# Altium project MotorController_STM32F4.PrjPcb
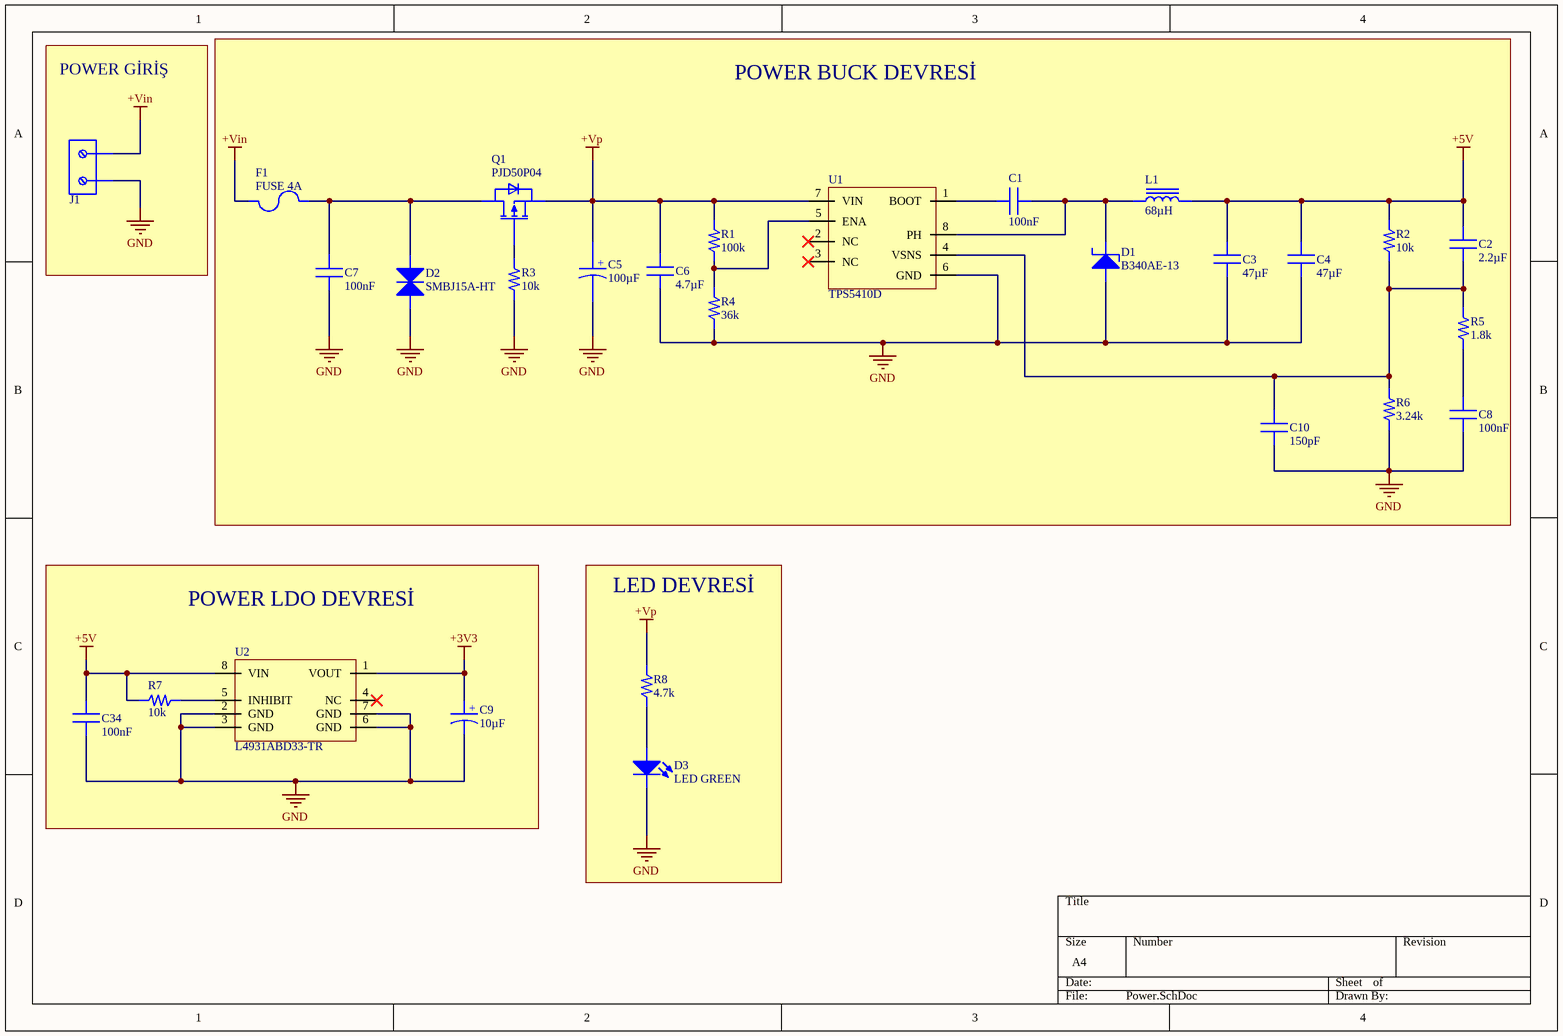
[diagram p0: Power.SchDoc]
4 sheets, 105 parts. Net scope: flat (ports and power ports of the same name join across sheets).
Board file: Motor_Controller.PcbDoc
Sheets:
  Power.SchDoc
  MCU.SchDoc
  Motor_Controller.SchDoc
  Sensors_and_External_Interfaces.SchDoc

## Sheet Power.SchDoc
size A4; DocumentNumber: 1; SheetNumber: 1; SheetTotal: 4

### Parts
C1  100nF  [CAP 0603 100NF]
C2  2.2µF  [CAP 0603 2.2uF]
C3  47µF  [CL32A476KOJNNNE]
C4  47µF  [CL32A476KOJNNNE]
C5  100µF  [CAP_EEHZA1H101P]
C6  4.7µF  [CAP 0603 4.7uF]
C7  100nF  [CAP 0603 100NF]
C8  100nF  [CAP 0603 100NF]
C9  10µF  [CAP_EEEFK1H100UR]
C10  150pF  [CAP 0603 150pF]
C34  100nF  [CAP 0603 100NF]
D1  B340AE-13  [DIODE B340AE-13]
D2  SMBJ15A-HT  [TVS DIODE SMBJ15A]
D3  LED GREEN  [LED GREEN 0603 APT1608CGCK]
F1  FUSE 4A  [FUSE 0805 MFU0805FF04000P100]
J1  2x1 5mm T.B.  [Terminal Block 2x1]  (value not drawn)
L1  68µH  [IND CBC3225T680KR 68uH]
Q1  PJD50P04  [TO252 (DPAK) IRFR024NTRPBF]
R1  100k  [RES 0402 ROYALOHM GENERAL]
R2  10k  [RES 0402 ROYALOHM GENERAL]
R3  10k  [RES 0402 ROYALOHM GENERAL]
R4  36k  [RES 0402 ROYALOHM GENERAL]
R5  1.8k  [RES 0402 ROYALOHM GENERAL]
R6  3.24k  [RES 0402 ROYALOHM GENERAL]
R7  10k  [RES 0402 ROYALOHM GENERAL]
R8  4.7k  [ROYALOHM 0603 RES]
U1  TPS5410D  [SOIC127TPS5410DR]
U2  L4931ABD33-TR  [LDO L4931ABD33-TR SOIC8]

### Blocks framed on the sheet
POWER GİRİŞ: J1
POWER BUCK DEVRESİ: C1-C8 C10 D1 D2 F1 L1 Q1 R1-R6 U1
POWER LDO DEVRESİ: C9 C34 R7 U2
LED DEVRESİ: D3 R8

### Nets
+3V3: C9.1 U2.1(VOUT)
+5V: C2.2 C3.2 C4.2 C34.2 L1.2 R2.2 R7.1 U2.8(VIN)
+Vin: F1.2 J1.1
+Vp: C5.1 C6.2 Q1.3(Source) R1.2 R8.2 U1.7(VIN)
GND: C3.1 C4.1 C5.2 C6.1 C7.1 C8.1 C9.2 C10.1 C34.1 D1.A(Anode) D2.1(A) D3.C(Cathode) J1.2 R3.1 R4.1 R6.1 U1.6(GND) U2.2(GND) U2.3(GND) U2.6(GND) U2.7(GND)
NetC1_1: C1.1 U1.1(BOOT)
NetC1_2: C1.2 D1.C(Cathode) L1.1 U1.8(PH)
NetC2_1: C2.1 C10.2 R2.1 R5.2 R6.2 U1.4(VSNS)
NetC7_2: C7.2 D2.2(C) F1.1 Q1.4(Drain)
NetC8_2: C8.2 R5.1
NetD3_A: D3.A(Anode) R8.1
NetQ1_1: Q1.1(Gate) R3.2
NetR1_1: R1.1 R4.2 U1.5(ENA)
NetR7_2: R7.2 U2.5(INHIBIT)

Not connected (* = marked no-connect by the designer): U1 2(NC)* 3(NC)*; U2 4(NC)*

### Notes on the sheet
- (in symbol CAP 10µF Electrolytic) +
- (in symbol CAP 100µF) +

### Library data of the parts
C1 C7 C8 C34 = CAP 0603 100nF: MLCC (1608) 0603 100nF 50VDC ±10% X7R AUTOMOTIVE CL10B104KB85PNC; Manufacturer: SAMSUNG; Operation Temperature: -55 °C ~ +125 °C; Manufacturer Code: CL10B104KB85PNC; Manufacturer Site: https://www.ozdisan.com/en/p/smt-smd-and-mlcc-capacitors-184/samsung-cl10b104kb85pnc-522216; Package / Case: 0603 (1608 Metric); Capacitance: 100nF; Voltage Rating: 50 VDC; Tolerance: ±10 %; Dielectric Material: X7R; Mounting Type: SMT
C2 = CAP 0603 2.2uF: MLCC (1608) 0603 2.2uF 16VDC ±10% X5R CL10A225KO8NNNC; Manufacturer: SAMSUNG; Operation Temperature: -55 °C ~ +85 °C; Mounting Type: SMT; Dielectric Material: X5R; Tolerance: ±10 %; Voltage Rating: 16 VDC; Capacitance: 2.2µF; Package / Case: 0603 (1608 Metric); Manufacturer Site: https://www.ozdisan.com/en/p/smt-smd-and-mlcc-capacitors-184/samsung-cl10a225ko8nnnc-497655; Manufacturer Code: CL10A225KO8NNNC
C3 C4 = CAP 1210 47µF: MLCC 1210 47uF 16VDC ±10% X5R   CL32A476KOJNNNE; Manufacturer: SAMSUNG; Operation Temperature: -55 °C ~ +85 °C; Capacitance: 47µF; Voltage Rating: 16 VDC; Tolerance: ±10 %; Dielectric Material: X5R; Manufacturer Site: https://www.ozdisan.com/en/p/smt-smd-and-mlcc-capacitors-184/samsung-cl32a476kojnnne-423179; Manufacturer Code: CL32A476KOJNNNE
C5 = CAP 100µF: CAP.EL.100µF 50V 10.5x10.5 105C SMD; Manufacturer: Panasonic; Manufacturer Code: EEH-ZA1H101P; Capacitor Type: Hybrid; Voltage Value: 50VDC; Tolerance: ±20 %; Surge Current: 2 A; Capacitance: 100µF; Package: Radial; Operating Temp.: -55 °C ~ +105 °C; Manufacturer Site: https://www.ozdisan.com/p/aluminyum-kapasitorler-180/panasoniceurope-eehza1h101p-614536
C6 = CAP 0603 4.7uF CL10A475KL8NRNC: MLCC (1608) 0603 4.7uF 35VDC ±10% X5R CL10A475KL8NRNC; Manufacturer: SAMSUNG; Operation Temperature: -55 °C ~ +85 °C; Manufacturer Site: https://www.ozdisan.com/en/p/smt-smd-and-mlcc-capacitors-184/samsung-cl10a475kl8nrnc-620226; Manufacturer Code: CL10A475KL8NRNC; Package / Case: 0603 (1608 Metric); Capacitance: 4.7µF; Voltage Rating: 35 VDC; Tolerance: ±10 %; Dielectric Material: X5R; Mounting Type: SMT
C9 = CAP 10µF Electrolytic: CAP.EL.10uF 50V 5x5.8 105C 2000H AEC-Q200 SMT; Manufacturer: PANASONIC; Manufacturer Code: EEEFK1H100UR; Voltage Rating: 50 VDC; Tolerance: ±20 %; Capacitance: 10µF; Capacitor Type: Electrolytic; Operating Temperature: 85 mA; Manufacturer Site: https://www.ozdisan.com/en/p/aluminyum-kapasitorler-180/panasoniceurope-eeefk1h100ur-1102281
C10 = CAP 0603 150pF: MLCC (1608) 0603 150pF 50VDC ±5% C0G (NP0) CL10C151JB8NNNC; Manufacturer: SAMSUNG; Operation Temperature: -55 °C ~ +125 °C; Manufacturer Code: CL10C151JB8NNNC; Manufacturer Site: https://www.ozdisan.com/en/p/smt-smd-and-mlcc-capacitors-184/samsung-cl10c151jb8nnnc-29957; Capacitance: 150pF; Package / Case: 0603 (1608 Metric); Voltage Rating: 50 VDC; Tolerance: ±5 %; Dielectric Material: C0G (NP0); Mounting Type: SMT
D1 = DIODE SCHOTTKY B340AE-13: DIODE SCHOTTKY 3A 40V SMA DO-214AC; Manufacturer: DIODES; Non-Repetitive Peak Forward Surge Current: 80A; Forward Voltage Drop: 0.45V; Peak Repetitive Reverse Voltage (VRRM): 40V; Average Rectified Current: 3A; Operating Temperature: -55 °C ~ +150 °C; Manufacturer Site: https://www.ozdisan.com/en/p/schottky-diodes-385/diodes-b340ae-13-736716; Manufacturer Code: B340AE-13
D2 = DIODE TVS SMBJ15A-HT: DIODE TVS 600W 15V DO214AA SMB; pin to pad: 1>A 2>C; Manufacturer: HOTTECH; Direction: Uni-Direction; Peak Pulse Current: 24.6; Manufacturer Site: https://www.ozdisan.com/p/TVS-Diodes-386/hottech-smbj15a-ht-503592?gad_source=1&gad_campaignid=22862662318&gbraid=0AAAAADZaco9GRDpwp6nwxImxnSPU74-HV&gclid=CjwKCAiAmp3LBhAkEiwAJM2JUNsfUTvu17OkGEIhWr_5BT7x3v2LizKiIaGxyMlL1g7MMILW0EtdSxoCxEMQAvD_BwE; Category: TVS; Vwm: 15V; Operating Temp.: -55 °C ~ +150 °C; Manufacturer Code: SMBJ15A-HT
D3 = SMD LED GREEN APT1608CGCK: LED GREEN CLEAR CHIP SMD; Manufacturer: KINGBRIGHT; Max Power: 75 mW; Light Intensity: 18 - 35 cmd; Transmission Voltage: 2.1 - 2.5V; Transmission Current: 30 mA; Manufacturer Site: https://www.ozdisan.com/p/sinyal-ledler-tek-renkli-361/kingbright-apt1608cgck-1050108; Color: Green; Package Size: 0603; Operating Temp.: -30 °C ~ +85 °C; Manufacturer Code: APT1608CGCK
F1 = FUSE: FUSE BOARD MOUNT 0805 4A 32VDC; Manufacturer: VISHAY; Manufacturer Code: MFU0805FF04000P100; Breaking Capacity: 50A; Mounting Type: SMT; Fuse Type: Fuse Board; Current Rating: 4A; Voltage Rating: 32VDC; Operating Temp.: -55°C~+125 °C; Manufacturer Site: https://www.ozdisan.com/p/sigortalar-849/vishay-mfu0805ff04000p100-617478
J1 = Terminal Block 2x1: TERM.BLK.5.00MM 2P PCB TYPE 0 BOY BLUE; Manufacturer: DEGSON; Manufacturer Code: DG301-5.0-02P-12-00AH; Voltage Rating: 300V; Current Rating: 15A; Mounting Type: THT; Number of Pins: 2; Operating Temp.: -40°C~+105 °C; Manufacturer Site: https://www.ozdisan.com/p/pcb-klemensler-410/degson-dg301-5-0-02p-12-00ah-349366
L1 = INDUCTOR 68µH SMD 744066680: INDUCTOR FIXED 68UH 10x10mm SMD 744066680; Manufacturer: WURTH; Tolerance: ±30 %; Current Rating: 1.5A; DC Resistance (DCR): 185 m Ohms; Manufacturer Site: https://www.ozdisan.com/p/sabit-induktorler-468/wurth-744066680-635583; Inductance: 68µH; Operating Temperature: -40 °C ~ +125 °C; Manufacturer Code: 744066680
Q1 = P-CH Mosfet 40V 9A PJD50P04-AU_L2_000A1: MOSFET DIS.50A 40V P-CH AUTOMOTIVE TO-252AA SMT; Manufacturer: PANJIT; Power Dissipation: 70 W; Rds On: 10 m Ohms; Current (25°C): 50 A; Voltage: 40 V; Fet Type: P-CH; Package / Case: TO252 (DPAK); Mounting Type: SMT; Manufacturer Site: https://www.ozdisan.com/en/p/discrete-mosfets-435/panjit-pjd50p04-au-l2-000a1-979715; Manufacturer Code: PJD50P04-AU_L2_000A1
R1 = RES 0402 100k 0402WGF1003TCE: RES.(1005) 0402 100K Ohms 1% 1/16W 100PPM / 0402WGF1003TCE; Manufacturer: ROYALOHM; Tolerance: ±5 %; Max Working Current: 1A; Max Working Voltage: 50V; Manufacturer Site: https://www.ozdisan.com/p/smt-smd-ve-cip-direncler-194/royalohm-0402wgf1003tce-359898; Power: 1/16 W; Package / Case: 0402; Manufacturer Code: 0402WGF1003TCE; Resistance Value: 100 k Ohms
R2 R3 R7 = RES 0402 10k: RES.(1005) 0402 10K Ohms 5% 1/16W 100PPM 0402WGJ0103TCE; Manufacturer: ROYALOHM; Tolerance: %5; Voltage Rating: 5V; Manufacturer Site: https://www.ozdisan.com/p/smt-smd-ve-cip-direncler-194/royalohm-0402wgj0103tce-362331; Package Size: 0402; Manufacturer Code: 0402WGJ0103TCE; Power: 1/16W; Resistance Value: 10k Ohms
R4 = RES 0402 36k 0402WGF3602TCE: RES.(1005) 0402 36K Ohms 1% 1/16W 100PPM 0402WGF3602TCE; Manufacturer: ROYALOHM; Power: 1/16 W-S; Max. Working Voltage: 50V; Max. Working Current: 1A; Manufacturer Site: https://www.ozdisan.com/p/smt-smd-ve-cip-direncler-194/royalohm-0402wgf3602tce-359889; Resistance Value: 36 k Ohms; Tolerance: ±1 %; Manufacturer Code: 0402WGF3602TCE
R5 = RES 0402 1.8k 0402WGJ0182TCE: RES.(1005) 0402 1.8K Ohms 5% 1/16W 100PPM 0402WGJ0182TCE; Manufacturer: ROYALOHM; Working Voltage: 50 V; Tolerance: ±5 %; Resistance Value: 1.8 k Ohms; Power: 1/16 W; Manufacturer Code: 0402WGJ0182TCE; Manufacturer Site: https://www.ozdisan.com/p/smt-smd-ve-cip-direncler-194/royalohm-0402wgj0182tce-506663
R6 = RES 0402 3.24k 0402WGF3241TCE: RES 0805 3.24k Ohms 1% 1/8W-S 100PPM 0402WGF3241TCE; Manufacturer: ROYALOHM; Power: 1/16 W-S; Working Voltage: 50V; Max Working Current: 1A; Manufacturer Site: https://www.ozdisan.com/p/smt-smd-ve-cip-direncler-194/royalohm-0402wgf3241tce-506267; Resistance Value: 3.24 k Ohms; Tolerance: ±1 %; Manufacturer Code: 0402WGF3241TCE
R8 = RES 0402 4.7k 0603SAJ0472T5E: RES.(1608) 0603 4.7K Ohms 5% 1/10W-S 100PPM 0603SAJ0472T5E; Manufacturer: ROYALOHM; Voltage Rating: 50V; Power: 1/16W; Package Size: 0402; Tolerance: ±5 %; Manufacturer Site: https://www.ozdisan.com/p/smt-smd-ve-cip-direncler-194/royalohm-0603saj0472t5e-336241; Manufacturer Code: 0603SAJ0472T5E; Resistance Value: 4.7k Ohms
U1 = Buck Converter TPS5410D: IC-5410DR REG BUCK ADJ 1A 8SOIC SMD TI; Manufacturer: TEXAS TI; Switching Function: Step-Down; Output Type: Adjustable; Input Voltage: 5.5 to 36 V; Switching Frequency: 500 kHz; Mounting Type: SMT; Package / Case: SOIC8; Output Voltage: Output Voltage; Output Current: 1A; Operating Temperature: -40 °C ~ +125 °C; Manufacturer Site: https://www.ozdisan.com/en/p/dc-dc-voltaj-regulatorleri-275/texas-tps5410dr-442302; Manufacturer Code: TPS5410D
U2 = LDO L4931ABD33: IC REG LINEAR 3.3V 250MA 8SO L4931ABD33; Manufacturer: STM; Input Voltage (Operating): 4 to 20 V; Output Voltage: 3.3 V; Output Current: 250 mA; Operating Temperature: -40 °C ~ +125 °C; Manufacturer Site: https://www.ozdisan.com/en/p/linear-voltage-regulators-279/stm-l4931abd33-tr-1325219; Manufacturer Code: L4931ABD33

## Sheet MCU.SchDoc: Motor Controller Board
size A4; DrawnBy: Hüseyin Yanar; DocumentNumber: 2; Revision: VER 1.0; SheetNumber: 2; SheetTotal: 4
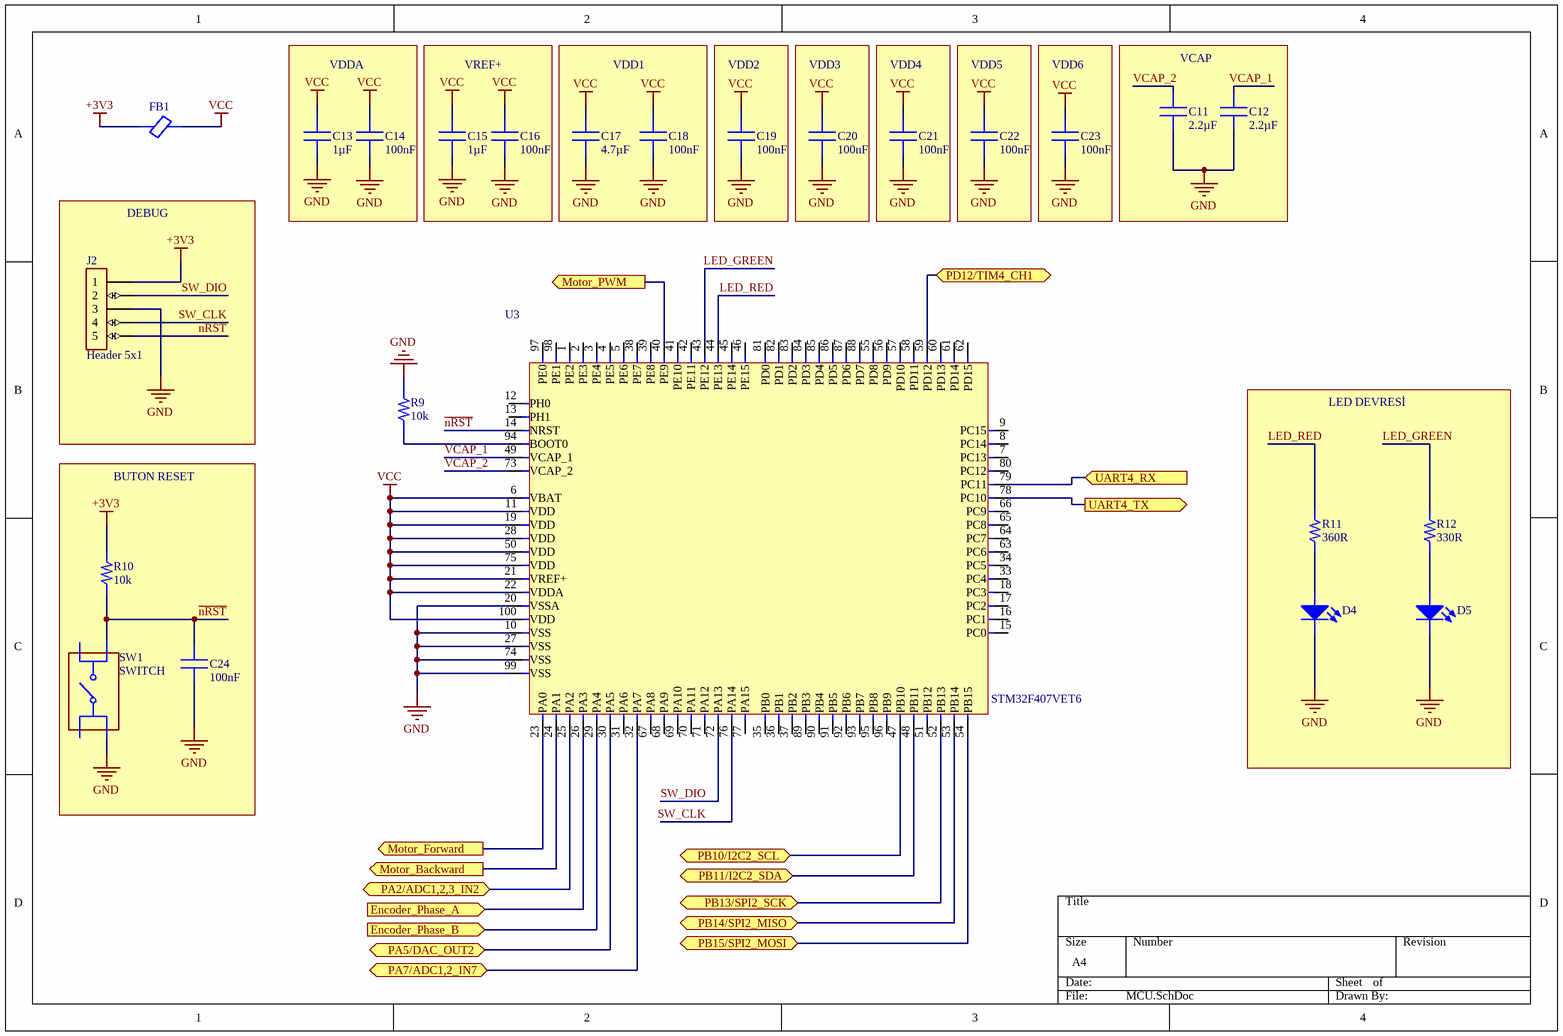
[diagram p1: MCU.SchDoc]

### Parts
C11  2.2µF  [CAP 0402 2.2UF]
C12  2.2µF  [CAP 0402 2.2UF]
C13  1µF  [CAP 1uF 0402]
C14  100nF  [CAP 100nF 0402]
C15  1µF  [CAP 1uF 0402]
C16  100nF  [CAP 100nF 0402]
C17  4.7µF  [CAP 0402 4.7uF]
C18  100nF  [CAP 100nF 0402]
C19  100nF  [CAP 100nF 0402]
C20  100nF  [CAP 100nF 0402]
C21  100nF  [CAP 100nF 0402]
C22  100nF  [CAP 100nF 0402]
C23  100nF  [CAP 100nF 0402]
C24  100nF  [CAP 100nF 0402]
D4  LED RED  [LED RED 0603 APT1608EC]  (value not drawn)
D5  LED GREEN  [LED GREEN 0603 APT1608CGCK]  (value not drawn)
FB1  BLM18PG221SN1D  [FB 0603 BLM18PG221SN1D]  (value not drawn)
J2  Header 5x1  [5x1 Header]
R9  10k  [RES 0402 ROYALOHM GENERAL]
R10  10k  [RES 0402 ROYALOHM GENERAL]
R11  360R  [ROYALOHM 0603 RES]
R12  330R  [ROYALOHM 0603 RES]
SW1  SWITCH  [PTS647SM50SMTR2 SMD BUTTON]
U3  STM32F407VET6  [LQFP100-0.5-13.8X13.8MM]

### Blocks framed on the sheet
VDDA: C13 C14
VREF+: C15 C16
VDD1: C17 C18
VDD2: C19
VDD3: C20
VDD4: C21
VDD5: C22
VDD6: C23
VCAP: C11 C12
DEBUG: J2
LED DEVRESİ: D4 D5 R11 R12
BUTON RESET: C24 R10 SW1

### Ports
Encoder_Phase_A (in, see Sensors_and_External_Interfaces[1A]), Encoder_Phase_B (in, see Sensors_and_External_Interfaces[1B]), Motor_Backward (out, see Motor_Controller[1A]), Motor_Forward (out, see Motor_Controller[1A]), Motor_PWM (out, see Motor_Controller[3C]), PA2/ADC1,2,3_IN2 (bidir, see Sensors_and_External_Interfaces[3B]), PA5/DAC_OUT2 (bidir, see Sensors_and_External_Interfaces[3B]), PA7/ADC1,2_IN7 (bidir, see Sensors_and_External_Interfaces[3B]), PB10/I2C2_SCL (bidir, see Sensors_and_External_Interfaces[3A]), PB11/I2C2_SDA (bidir, see Sensors_and_External_Interfaces[3A]), PB13/SPI2_SCK (bidir, see Sensors_and_External_Interfaces[3A]), PB14/SPI2_MISO (bidir, see Sensors_and_External_Interfaces[3A]), PB15/SPI2_MOSI (bidir, see Sensors_and_External_Interfaces[3A]), PD12/TIM4_CH1 (bidir, see Sensors_and_External_Interfaces[3A]), UART4_RX (in, see Sensors_and_External_Interfaces[3A]), UART4_TX (out, see Sensors_and_External_Interfaces[3B])

### Nets
+3V3: FB1.1 J2.1 R10.2
GND: C11.1 C12.1 C13.1 C14.1 C15.1 C16.1 C17.1 C18.1 C19.1 C20.1 C21.1 C22.1 C23.1 C24.1 D4.C(Cathode) D5.C(Cathode) J2.3 R9.2 SW1.2(A2) U3.10(VSS) U3.20(VSSA) U3.27(VSS) U3.74(VSS) U3.99(VSS)
VCC: C13.2 C14.2 C15.2 C16.2 C17.2 C18.2 C19.2 C20.2 C21.2 C22.2 C23.2 FB1.2 U3.6(VBAT) U3.11(VDD) U3.19(VDD) U3.21(VREF+) U3.22(VDDA) U3.28(VDD) U3.50(VDD) U3.75(VDD) U3.100(VDD)
~{nRST}: C24.2 J2.5 R10.1 SW1.4(B2) U3.14(NRST)
LED_GREEN: R12.2 U3.43(PE12)
LED_RED: R11.2 U3.44(PE13)
Motor_Backward: U3.24(PA1) ; port Motor_Backward
Motor_Forward: U3.23(PA0) ; port Motor_Forward
SW_CLK: J2.4 U3.76(PA14)
SW_DIO: J2.2 U3.72(PA13)
VCAP_1: C12.2 U3.49(VCAP_1)
VCAP_2: C11.2 U3.73(VCAP_2)
NetD4_A: D4.A(Anode) R11.1
NetD5_A: D5.A(Anode) R12.1
NetJ4_1: U3.59(PD12) ; port PD12/TIM4_CH1
NetJ4_2: U3.54(PB15) ; port PB15/SPI2_MOSI
NetJ4_3: U3.53(PB14) ; port PB14/SPI2_MISO
NetJ4_4: U3.52(PB13) ; port PB13/SPI2_SCK
NetJ4_5: U3.48(PB11) ; port PB11/I2C2_SDA
NetJ4_6: U3.47(PB10) ; port PB10/I2C2_SCL
NetJ4_7: U3.32(PA7) ; port PA7/ADC1,2_IN7
NetJ4_8: U3.30(PA5) ; port PA5/DAC_OUT2
NetJ4_9: U3.25(PA2) ; port PA2/ADC1,2,3_IN2
NetR9_1: R9.1 U3.94(BOOT0)
NetR26_2: U3.40(PE9) ; port Motor_PWM
NetR35_2: U3.79(PC11) ; port UART4_RX
NetR36_2: U3.26(PA3) ; port Encoder_Phase_A
NetR37_2: U3.78(PC10) ; port UART4_TX
NetR38_2: U3.29(PA4) ; port Encoder_Phase_B

Not connected (* = marked no-connect by the designer): SW1 1(A1) 3(B1); U3 1(PE2) 2(PE3) 3(PE4) 4(PE5) 5(PE6) 7(PC13) 8(PC14) 9(PC15) 12(PH0) 13(PH1) 15(PC0) 16(PC1) 17(PC2) 18(PC3) 31(PA6) 33(PC4) 34(PC5) 35(PB0) 36(PB1) 37(PB2) 38(PE7) 39(PE8) 41(PE10) 42(PE11) 45(PE14) 46(PE15) 51(PB12) 55(PD8) 56(PD9) 57(PD10) 58(PD11) 60(PD13) 61(PD14) 62(PD15) 63(PC6) 64(PC7) 65(PC8) 66(PC9) 67(PA8) 68(PA9) 69(PA10) 70(PA11) 71(PA12) 77(PA15) 80(PC12) 81(PD0) 82(PD1) 83(PD2) 84(PD3) 85(PD4) 86(PD5) 87(PD6) 88(PD7) 89(PB3) 90(PB4) 91(PB5) 92(PB6) 93(PB7) 95(PB8) 96(PB9) 97(PE0) 98(PE1)

### Notes on the sheet
- VDDA 100nF ve 1µF VDDA/VSSA pinlerine en yakın olacak
  GND dönüşleri kısa olacak ve mümkünse analog GND bölgesine temiz inecek
  VDD 100nF’ler de her VDD pin grubuna yakın olacak.

### Library data of the parts
C11 C12 = CAP 0402 2.2uF CL05A225KO5NQNC: MLCC (1005) 0402 2.2uF 16VDC ±10% X5R CL05A225KO5NQNC; Manufacturer: SAMSUNG; Operation Temperature: -55 °C ~ +85 °C; Manufacturer Code: CL05A225KO5NQNC; Manufacturer Site: https://www.ozdisan.com/en/p/smt-smd-and-mlcc-capacitors-184/samsung-cl05a225ko5nqnc-521869; Package / Case: 0402 (1005 Metric); Capacitance: 2.2µF; Voltage Rating: 16 VDC; Tolerance: ±10 %; Dielectric Material: X5R
C13 C15 = CAP 0402 1µF CL05A105KO5NNNC: MLCC (1005) 0402 1uF 16VDC ±10% X5R CL05A105KO5NNNC; Manufacturer: SAMSUNG; Operation Temperature: -55 °C ~ +85 °C; Manufacturer Code: CL05A105KO5NNNC; Manufacturer Site: https://www.ozdisan.com/en/p/smt-smd-and-mlcc-capacitors-184/samsung-cl05a105ko5nnnc-402953; Package / Case: 0402 (1005 Metric); Capacitance: 1µF; Voltage Rating: 16 VDC; Tolerance: ±10 %; Dielectric Material: X5R; Mounting Type: SMT
C14 C16 C18-C23 = CAP 0402 100nF: MLCC (1005) 0402 100nF 16VDC ±10% X7R; Manufacturer Code: CL05B104KO5NNNC; Manufacturer: SAMSUNG; Operation Temperature: -55 °C ~ +125 °C; Dielectric Material: X7R; Tolerance: ±10 %; Voltage Rating: 16 VDC; Package / Case: 0402 (1005 Metric); Mounting Type: SMT; Manufacturer Site: https://www.ozdisan.com/en/p/smt-smd-and-mlcc-capacitors-184/samsung-cl05b104ko5nnnc-336698; Capacitance: 100 nF
C17 = CAP 0402 4.7uF CL05A475MO5LUNC: MLCC (1005) 0402 4.7uF 16VDC ±20% X5R CL05A475MO5LUNC; Manufacturer: SAMSUNG; Operation Temperature: -55 °C ~ +85 °C; Manufacturer Code: CL05A475MO5LUNC; Manufacturer Site: https://www.ozdisan.com/en/p/smt-smd-and-mlcc-capacitors-184/samsung-cl05a475mo5lunc-1212612; Package / Case: 0402 (1005 Metric); Capacitance: 4.7µF; Voltage Rating: 16 VDC; Tolerance: ±20 %; Dielectric Material: X5R; Mounting Type: SMT
C24 = CAP 0402 100nF CL05B104KO5NNNC: MLCC (1005) 0402 100nF 16VDC ±10% X7R CL05B104KO5NNNC; Manufacturer: SAMSUNG; Operation Temperature: -55 °C ~ +125 °C; Dielectric Material: X7R; Tolerance: ±10 %; Voltage Rating: 16 VDC; Package / Case: 0402 (1005 Metric); Mounting Type: SMT; Manufacturer Site: https://www.ozdisan.com/en/p/smt-smd-and-mlcc-capacitors-184/samsung-cl05b104ko5nnnc-336698; Manufacturer Code: CL05B104KO5NNNC; Capacitance: 100 nF
D4 = SMD LED RED APT1608EC: LED SMD 0603 RED 617nm CLEAR CHIP SMD; Manufacturer: KINGBRIGHT; Max Power: 75 mW; Transmission Voltage: 2.1V - 2.5V; Transmission Current: 30 mA; Manufacturer Site: https://www.ozdisan.com/p/sinyal-ledler-tek-renkli-361/kingbright-apt1608ec-1046629; Operating Temp.: -40 °C ~ +85 °C; Manufacturer Code: APT1608EC
D5 = SMD LED GREEN APT1608CGCK: as D3 on sheet Power; Manufacturer Site: https://www.ozdisan.com/p/sinyal-ledler-tek-renkli-361/kingbright-apt1608cgck-1050108; Color: Green; Package Size: 0603; Operating Temp.: -30 °C ~ +85 °C; Manufacturer Code: APT1608CGCK
FB1 = Ferrite Bead BLM18PG221SN1D: FERRITE BEAD 0805 330R/100MHZ  BLM18PG221SN1D  SMD; Manufacturer: MURATA; Impedance: 330 Ohms; Tolerance: ±25 %; Current: 1.5 A; DC Resistor(DCR): 100 m Ohms; Package Size: 0805; Manufacturer Code: BLM18PG221SN1D; Manufacturer Site: https://www.ozdisan.com/p/bead-feritler-469/murata-blm18pg221sn1d-484088
J2 = Header 5x1 for SWD: PIN HEADER 5PIN (5x1) 2.54mm THT V/T; Manufacturer: CONNFLY; Manufacturer Code: DS1021-1X5SF11-B; Pin Overall Length: 15.04 mm; Pin Spacing: 2.54 mm; Insulation Height: 2.5 mm; Manufacturer Site: https://www.ozdisan.com/p/pin-headerlar-293/connfly-ds1021-1x5sf11-b-423156
R9 R10 = RES 0402 10k: as R2 on sheet Power; Manufacturer Site: https://www.ozdisan.com/p/smt-smd-ve-cip-direncler-194/royalohm-0402wgj0103tce-362331; Package Size: 0402; Manufacturer Code: 0402WGJ0103TCE; Power: 1/16W; Resistance Value: 10k Ohms
R11 = RES 0603 360R 0603SAJ0361T5E: RES.(1608) 0603 360 Ohms 5% 1/10W-S 100PPM 0603SAJ0361T5E; Manufacturer: ROYALOHM; Working Voltage: 75 V; Manufacturer Code: 0603SAJ0361T5E; Manufacturer Site: https://www.ozdisan.com/en/p/smt-smd-and-chip-resistors-194/royalohm-0603saj0361t5e-404344; Resistance Value: 360 Ohms; Tolerance: ±5 %
R12 = RES 0603 330R: RES 0603 330 Ohms 5% 1/10W-S 100PPM; Manufacturer Code: 0603SAJ0331T5E; Manufacturer: ROYALOHM; Power: 1/10W; Voltage Rating: 75V; Resistance Value: 330 Ohm; Manufacturer Site: https://www.ozdisan.com/p/smt-smd-ve-cip-direncler-194/royalohm-0603saj0331t5e-336229; Tolerance: ±5 %; Package Size: 0603
SW1 = SMD BUTTON PTS647SM50SMTR2LFS: SWITCH TACT 6.00x6.00 8.00mm 160gF SMT V/T PTS647SM50SMTR2LFS; Manufacturer: LITTELFUSE-C&K; Max Current: 50mA; Max Voltage: 12V; Actuating Force: 180 gF; Manufacturer Site: https://www.ozdisan.com/p/tact-sivicler-485/littelfuse-ck-pts647sm50smtr2lfs-1018623; Dimension: 4.5x4.5 mm; Operating Temp.: -25 °C ~ +70 °C; Manufacturer Code: PTS647SM50SMTR2LFS
U3 = MCU-STM32F407VET6(LQFP100): IC-32F407V MCU 32BIT 512KB FLASH 100LQFP; Manufacturer: STM; Manufacturer Code: STM32F407VET6TR; Supply Voltage: 1.8 to 3.6 V; Speed: 168 MHz; Program Memory Size: 512 KB (512 K x 8); Package / Case: LQFP100; Memory Type: FLASH; Number of Bits: 32 Bit; Operating Temperature: -40 °C ~ +85 °C; Manufacturer Site: https://www.ozdisan.com/en/p/microcontrollers-218/stm-stm32f407vet6tr-492058

## Sheet Motor_Controller.SchDoc
size A4; DocumentNumber: 3; SheetNumber: 3; SheetTotal: 4
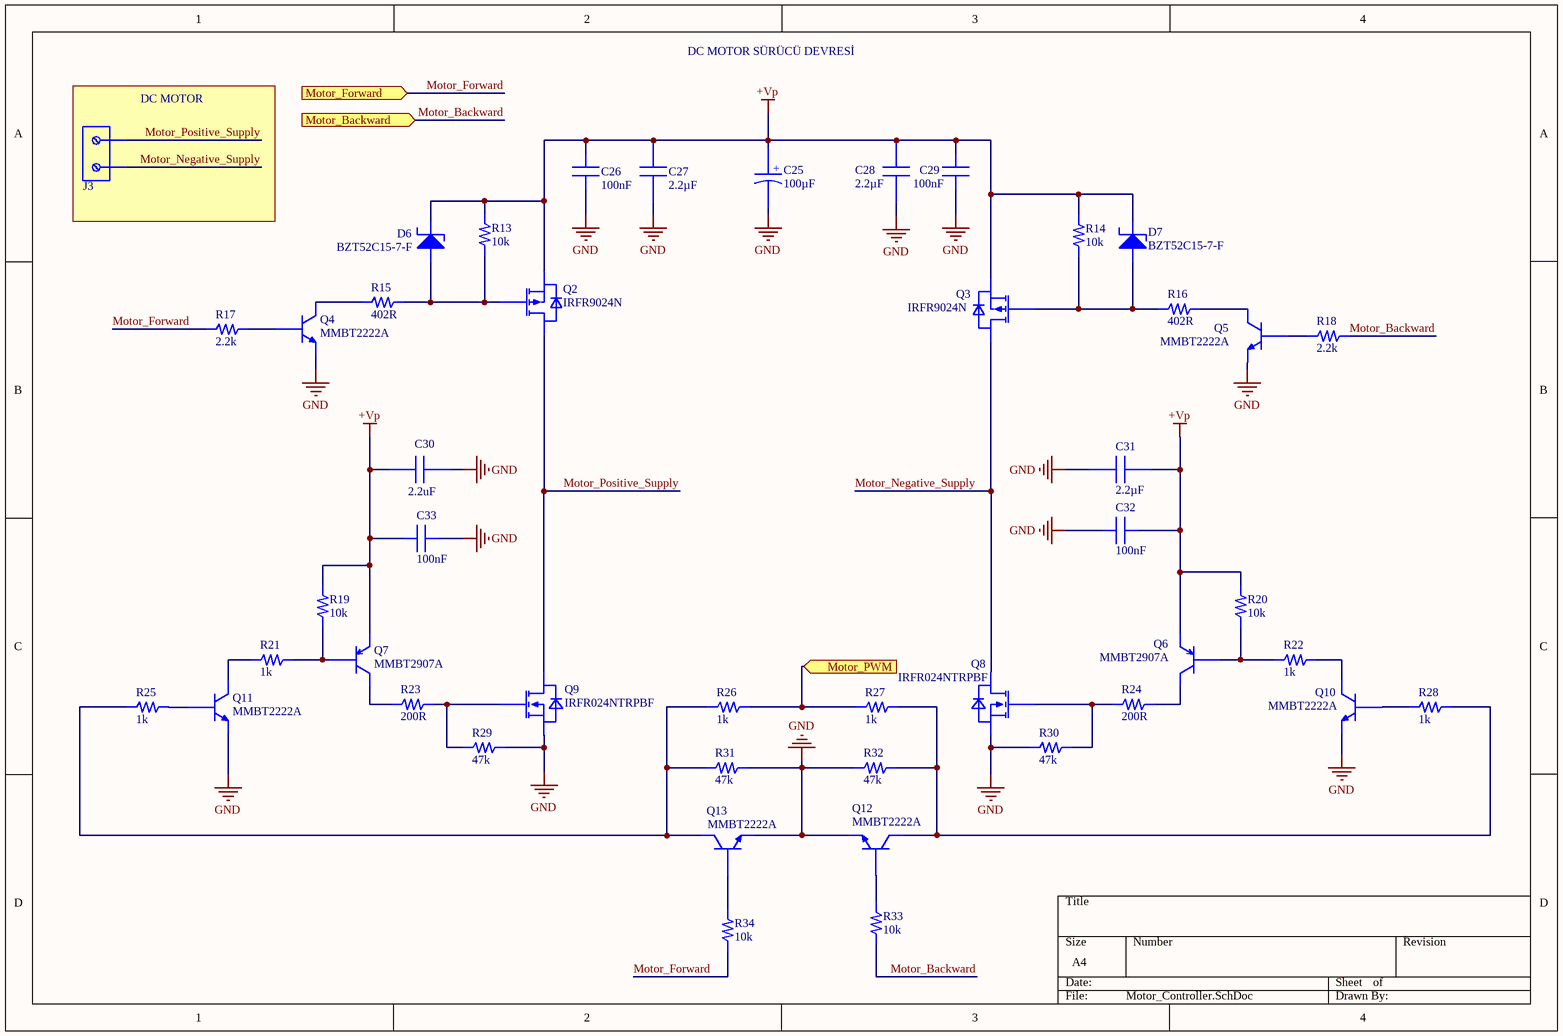
[diagram p2: Motor_Controller.SchDoc]

### Parts
C25  100µF  [CAP_EEHZA1H101P]
C26  100nF  [CL21B104KBCNNNC]
C27  2.2µF  [CAPC3216X180N]
C28  2.2µF  [CAPC3216X180N]
C29  100nF  [CL21B104KBCNNNC]
C30  2.2µF  [CAPC3216X180N]  (value not drawn)
C31  2.2µF  [CAPC3216X180N]
C32  100nF  [CL21B104KBCNNNC]
C33  100nF  [CL21B104KBCNNNC]
D6  BZT52C15-7-F  [DIODE ZENER BZT52C15-7-F]
D7  BZT52C15-7-F  [DIODE ZENER BZT52C15-7-F]
J3  2x1 5mm T.B.  [Terminal Block 2x1]  (value not drawn)
Q2  IRFR9024N  [TO252 (DPAK) IRFR024NTRPBF]
Q3  IRFR9024N  [TO252 (DPAK) IRFR024NTRPBF]
Q4  MMBT2222A  [SOT23-3 MMBT2222A-HT]
Q5  MMBT2222A  [SOT23-3 MMBT2222A-HT]
Q6  MMBT2907A  [TRANS_MMBT2907A]
Q7  MMBT2907A  [TRANS_MMBT2907A]
Q8  IRFR024NTRPBF  [TO252 (DPAK) IRFR024NTRPBF]
Q9  IRFR024NTRPBF  [TO252 (DPAK) IRFR024NTRPBF]
Q10  MMBT2222A  [SOT23-3 MMBT2222A-HT]
Q11  MMBT2222A  [SOT23-3 MMBT2222A-HT]
Q12  MMBT2222A  [SOT23-3 MMBT2222A-HT]
Q13  MMBT2222A  [SOT23-3 MMBT2222A-HT]
R13  10k  [RES 0402 ROYALOHM GENERAL]
R14  10k  [RES 0402 ROYALOHM GENERAL]
R15  402R  [CHIP RES 0805 1k]
R16  402R  [CHIP RES 0805 1k]
R17  2.2k  [RES 0402 ROYALOHM GENERAL]
R18  2.2k  [RES 0402 ROYALOHM GENERAL]
R19  10k  [RES 0402 ROYALOHM GENERAL]
R20  10k  [RES 0402 ROYALOHM GENERAL]
R21  1k  [RES 0402 ROYALOHM GENERAL]
R22  1k  [RES 0402 ROYALOHM GENERAL]
R23  200R  [CHIP RES 0805 1k]
R24  200R  [CHIP RES 0805 1k]
R25  1k  [RES 0402 ROYALOHM GENERAL]
R26  1k  [RES 0402 ROYALOHM GENERAL]
R27  1k  [RES 0402 ROYALOHM GENERAL]
R28  1k  [RES 0402 ROYALOHM GENERAL]
R29  47k  [RES 0402 ROYALOHM GENERAL]
R30  47k  [RES 0402 ROYALOHM GENERAL]
R31  47k  [RES 0402 ROYALOHM GENERAL]
R32  47k  [RES 0402 ROYALOHM GENERAL]
R33  10k  [RES 0402 ROYALOHM GENERAL]
R34  10k  [RES 0402 ROYALOHM GENERAL]

### Blocks framed on the sheet
DC MOTOR: J3

### Ports
Motor_Backward (in, see MCU[1D]), Motor_Forward (in, see MCU[1D]), Motor_PWM (in, see MCU[2B])

### Nets
+Vp: C25.1 C26.2 C27.2 C28.2 C29.2 C30.1 C31.2 C32.2 C33.1 D6.2(Cathode) D7.2(Cathode) Q2.3(Source) Q3.3(Source) Q6.2(Emitter) Q7.2(Emitter) R13.2 R14.2 R19.2 R20.2
GND: C25.2 C26.1 C27.1 C28.1 C29.1 C30.2 C31.1 C32.1 C33.2 Q4.2(Emitter) Q5.2(Emitter) Q8.3(Source) Q9.3(Source) Q10.2(Emitter) Q11.2(Emitter) Q12.2(Emitter) Q13.2(Emitter) R29.2 R30.1 R31.2 R32.1
Motor_Backward: R18.2 R33.1 ; port Motor_Backward
Motor_Forward: R17.1 R34.1 ; port Motor_Forward
Motor_Negative_Supply: J3.2 Q3.4(Drain) Q8.4(Drain)
Motor_Positive_Supply: J3.1 Q2.4(Drain) Q9.4(Drain)
NetD6_1: D6.1(Anode) Q2.1(Gate) R13.1 R15.2
NetD7_1: D7.1(Anode) Q3.1(Gate) R14.1 R16.1
NetQ4_1: Q4.1(Base) R17.2
NetQ4_3: Q4.3(Collector) R15.1
NetQ5_1: Q5.1(Base) R18.1
NetQ5_3: Q5.3(Collector) R16.2
NetQ6_1: Q6.1(Base) R20.1 R22.1
NetQ6_3: Q6.3(Collector) R24.2
NetQ7_1: Q7.1(Base) R19.1 R21.2
NetQ7_3: Q7.3(Collector) R23.1
NetQ8_1: Q8.1(Gate) R24.1 R30.2
NetQ9_1: Q9.1(Gate) R23.2 R29.1
NetQ10_1: Q10.1(Base) R28.1
NetQ10_3: Q10.3(Collector) R22.2
NetQ11_1: Q11.1(Base) R25.2
NetQ11_3: Q11.3(Collector) R21.1
NetQ12_1: Q12.1(Base) R33.2
NetQ12_3: Q12.3(Collector) R27.2 R28.2 R32.2
NetQ13_1: Q13.1(Base) R34.2
NetQ13_3: Q13.3(Collector) R25.1 R26.1 R31.1
NetR26_2: R26.2 R27.1 ; port Motor_PWM

### Notes on the sheet
- DC MOTOR SÜRÜCÜ DEVRESİ
- (in symbol CAP 100µF) +
- (in symbol CAP 1206 2.2µF) 2.2uF

### Library data of the parts
C25 = CAP 100µF: as C5 on sheet Power; Capacitance: 100µF; Package: Radial; Operating Temp.: -55 °C ~ +105 °C; Manufacturer Site: https://www.ozdisan.com/p/aluminyum-kapasitorler-180/panasoniceurope-eehza1h101p-614536
C26 C29 C32 C33 = CAP 0805 100nF: MLCC 0805 100nF 50VDC ±10% X7R; Manufacturer: SAMSUNG; Capacitance: 100nF; Voltage Rating: 50VDC; Dielectric: X7R; Package Size: 0805; Operating Temp.: -55 °C ~ +125 °C; Tolerance: ±10 %; Manufacturer Site: https://www.ozdisan.com/p/smt-smd-ve-mlcc-kapasitorler-184/samsung-cl21b104kbcnnnc-14777; Manufacturer Code: CL21B104KBCNNNC
C27 C28 C30 C31 = CAP 1206 2.2µF: MLCC 1206 2.2µF 50VDC ±10% X7R; Manufacturer: SAMSUNG; Manufacturer Code: CL31B225KBHVPNE; Capacitance: 2.2µF; Voltage Value: 50VDC; Tolerance: ±10 %; Dielectric: X7R; Operating Temp.: -55 °C ~ +125 °C; Manufacturer Site: https://www.ozdisan.com/p/smt-smd-ve-mlcc-kapasitorler-184/samsung-cl31b225kbhvpne-523411
D6 D7 = DIODE ZENER 15V BZT52C15-7-F: DIODE ZENER 500mW 15V ±5% SOD123 SMT; pin to pad: 1>A 2>C; Manufacturer: DIODES; Reverse Current: 100 nA; Manufacturer Site: https://www.ozdisan.com/p/zener-diyotlar-390/diodes-bzt52c15-7-f-444889; Zener Voltage: 15V; Operating Temp.: -65 °C ~ +150 °C; Tolerance: ±5 %; Power: 500 mW; Manufacturer Code: BZT52C15-7-F
J3 = Terminal Block 2x1: as J1 on sheet Power; Mounting Type: THT; Number of Pins: 2; Operating Temp.: -40°C~+105 °C; Manufacturer Site: https://www.ozdisan.com/p/pcb-klemensler-410/degson-dg301-5-0-02p-12-00ah-349366
Q2 Q3 = P Channel Mosfet IRFR9024N: MOSFET DIS.11A 55V P-CH TO252(DPAK) HEXFET SMT; Manufacturer: INFINEON; Manufacturer Code: IRFR9024NTRPBF; Power: 38 W; Current: 11 A; Operating Temp.: -55 °C ~ +150 °C; Voltage: 55 V; Fet Type: P-CH; Package: TO252 (DPAK); Manufacturer Site: https://www.ozdisan.com/p/discrete-mosfetler-435/infineon-irfr9024ntrpbf-474342
Q4 Q5 Q10-Q13 = NPN Transistor MMBT2222A-HT: TRANSISTOR DIS.600mA 40V NPN SOT23 EPITAXIAL SMT; Manufacturer: HOTTECH; Ic (Collector Current): 600 mA; Power: 250 mW; Channel: NPN; Vce ( Collector Emitter Voltage): 40V; Operating Temp.: -55 °C ~ +150 °C; Manufacturer Site: https://www.ozdisan.com/p/discrete-transistorler-442/hottech-mmbt2222a-ht-462248; Manufacturer Code: MMBT2222A-HT
Q6 Q7 = PNP Transistor MMBT2907A: TRANSISTOR DIS.600mA 60V PNP SOT23 GEN. SMT; Manufacturer: PANJIT; Manufacturer Code: MMBT2907A_R1_00001; Ic (Collector Current): 600 mA; Power: 225 mW; Channel: PNP; Vce (Collector Emitter Voltage): 60V; Operating Temp.: -55 °C ~ +150 °C; Manufacturer Site: https://www.ozdisan.com/p/discrete-transistorler-442/panjit-mmbt2907a-r1-00001-494451
Q8 Q9 = N Channel Mosfet IRFR024NTRPBF: MOSFET DIS.17A 55V N-CH TO252(DPAK) HEXFET SMT; Manufacturer: IR; Current: 17 A; Power: 45W; Operating Temp.: -55 °C ~ +175 °C; Fet Type: N - CH; Package: TO252 (DPAK); Voltage: 55 V; Manufacturer Site: https://www.ozdisan.com/p/discrete-mosfetler-435/ir-irfr024ntrpbf-372863; Manufacturer Code: IRFR024NTRPBF
R13 R14 R19 R20 R33 R34 = RES 0402 10k: as R2 on sheet Power; Manufacturer Site: https://www.ozdisan.com/p/smt-smd-ve-cip-direncler-194/royalohm-0402wgj0103tce-362331; Package Size: 0402; Manufacturer Code: 0402WGJ0103TCE; Power: 1/16W; Resistance Value: 10k Ohms
R15 R16 = RES 0805 402 Ohms 0402WGF4020TCE: RES.(2012) 0805 402 Ohms 1% 1/8W-S 100PPM 0805S8F4020T5E; Manufacturer: ROYALOHM; Max Working Current: 2A; Max Working Voltage: 150V; Power: 1/8 W; Manufacturer Code: 0805S8F4020T5E; Manufacturer Site: https://www.ozdisan.com/p/smt-smd-ve-cip-direncler-194/royalohm-0805s8f4020t5e-505424; Package / Case: 0805; Resistance Value: 402 Ohms; Tolerance: ±1 %; Mounting Type: SMT
R17 R18 = RES 0402 2.2k 0402WGF2201TCE: RES. 0805 2.2k Ohms 1% 1/8W-S 100PPM 0402WGF2201TCE; Manufacturer Code: 0805S8F2201T5E; Manufacturer: ROYALOHM; Tolerance: %1; Voltage Rating: 50V; Power: 1/16 W; Manufacturer Site: https://www.ozdisan.com/p/smt-smd-ve-cip-direncler-194/royalohm-0402wgf2201tce-359862; Package Size: 0402; Resistance Value: 2.2k Ohms
R21 R22 R25-R28 = RES 0402 1k HP02WAF1001TCE: RES.(1005) 0402 1K Ohms 1% 1/10W / HP02WAF1001TCE; Manufacturer: ROYALOHM; Voltage Rating: 50V; Resistance Value: 1k Ohms; Tolerance: ±1 %; Package Size: 0402; Manufacturer Code: HP02WAF1001TCE; Manufacturer Site: https://www.ozdisan.com/p/smt-smd-ve-cip-direncler-194/royalohm-hp02waf1001tce-603902
R23 R24 = RES 0805 200Ohms 0805S8J0201T5E: RES.(2012) 0805 200 Ohms 5% 1/8W-S 100PPM / 0805S8J0201T5E; Manufacturer: ROYALOHM; Max Working Current: 2A; Max Working Voltage: 150V; ComponentLink1Description: New link; ComponentLink1URL: *; Mounting Type: SMT; Tolerance: ±5 %; Resistance Value: 200 Ohms; Package / Case: 0805; Manufacturer Site: https://www.ozdisan.com/p/smt-smd-ve-cip-direncler-194/royalohm-0805s8j0201t5e-39150; Manufacturer Code: 0805S8J0201T5E
R29-R32 = RES 0402 47k HP02WAF4702TCE: RES.(1005) 0402 47K Ohms 1% 1/10W / HP02WAF4702TCE; Manufacturer: ROYALOHM; Voltage Rating: 50V; Max Working Current: 1A; Manufacturer Site: https://www.ozdisan.com/p/smt-smd-ve-cip-direncler-194/royalohm-0805s8j0473t5e-29835; Tolerance: ±1 %; Package Size: 0402; Manufacturer Code: HP02WAF4702TCE; Resistance Value: 47k Ohms

## Sheet Sensors_and_External_Interfaces.SchDoc
size A4; DocumentNumber: 4; SheetNumber: 4; SheetTotal: 4
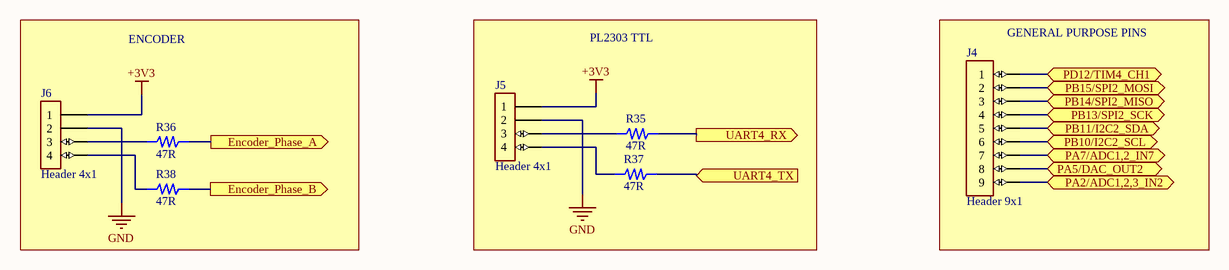
[diagram p3: Sensors_and_External_Interfaces.SchDoc]

### Parts
J4  Header 9x1  [9x1 Header]
J5  Header 4x1  [4x1 Header]
J6  Header 4x1  [4x1 Header]
R35  47R  [ROYALOHM 0603 RES]
R36  47R  [ROYALOHM 0603 RES]
R37  47R  [ROYALOHM 0603 RES]
R38  47R  [ROYALOHM 0603 RES]

### Blocks framed on the sheet
ENCODER: J6 R36 R38
PL2303 TTL: J5 R35 R37
GENERAL PURPOSE PINS: J4

### Ports
Encoder_Phase_A (out, see MCU[1D]), Encoder_Phase_B (out, see MCU[1D]), PA2/ADC1,2,3_IN2 (bidir, see MCU[1D]), PA5/DAC_OUT2 (bidir, see MCU[1D]), PA7/ADC1,2_IN7 (bidir, see MCU[1D]), PB10/I2C2_SCL (bidir, see MCU[2D]), PB11/I2C2_SDA (bidir, see MCU[2D]), PB13/SPI2_SCK (bidir, see MCU[2D]), PB14/SPI2_MISO (bidir, see MCU[2D]), PB15/SPI2_MOSI (bidir, see MCU[2D]), PD12/TIM4_CH1 (bidir, see MCU[3B]), UART4_RX (out, see MCU[3B]), UART4_TX (in, see MCU[3B])

### Nets
+3V3: J5.1 J6.1
GND: J5.2 J6.2
NetJ4_1: J4.1 ; port PD12/TIM4_CH1
NetJ4_2: J4.2 ; port PB15/SPI2_MOSI
NetJ4_3: J4.3 ; port PB14/SPI2_MISO
NetJ4_4: J4.4 ; port PB13/SPI2_SCK
NetJ4_5: J4.5 ; port PB11/I2C2_SDA
NetJ4_6: J4.6 ; port PB10/I2C2_SCL
NetJ4_7: J4.7 ; port PA7/ADC1,2_IN7
NetJ4_8: J4.8 ; port PA5/DAC_OUT2
NetJ4_9: J4.9 ; port PA2/ADC1,2,3_IN2
NetJ5_3: J5.3 R35.1
NetJ5_4: J5.4 R37.1
NetJ6_3: J6.3 R36.1
NetJ6_4: J6.4 R38.1
NetR35_2: R35.2 ; port UART4_RX
NetR36_2: R36.2 ; port Encoder_Phase_A
NetR37_2: R37.2 ; port UART4_TX
NetR38_2: R38.2 ; port Encoder_Phase_B

### Library data of the parts
J4 = Header 9x1: PIN HEADER 5PIN (5x1) 2.54mm THT V/T; Manufacturer: CONNFLY; Manufacturer Code: DS1021-1X9SF11-B; Pin Overall Length: 15.04 mm; Pin Spacing: 2.54 mm; Insulation Height: 2.5 mm; Mounting Type: THT V/T; Manufacturer Site: https://www.ozdisan.com/en/p/pin-headers-293/connfly-ds1021-1x9sf11-b-421995https://www.ozdisan.com/en/p/pin-headers-293/connfly-ds1021-1x9sf11-b-421995
J5 J6 = Header 4x1 for Encoder: PIN HEADER 5PIN (4x1) 2.54mm THT V/T; Manufacturer: AMPHENOL; Manufacturer Code: 68000-404HLF; Pin Overall Length: 15.04 mm; Insulation Height: 2.5 mm; Pin Spacing: 2.54 mm; Manufacturer Site: https://www.ozdisan.com/p/pin-headerlar-293/amphenol-68000-404hlf-1056428
R35-R38 = RES 0603 47R: RES. 0603 47 Ohms 1% 1/8W-S 100PPM; Manufacturer Code: CQ03SAJ0470T5E; Manufacturer: ROYALOHM; Power: 1/8W; Tolerance: %1; Voltage Rating: 150V; Resistance Value: 47 Ohms; Manufacturer Site: https://www.ozdisan.com/p/smt-smd-ve-cip-direncler-194/royalohm-cq03saj0470t5e-587918; Package Size: 0603

## Nets that join several sheets
+3V3: Power (C9.1 U2.1), MCU (FB1.1 J2.1 R10.2), Sensors_and_External_Interfaces (J5.1 J6.1)
+Vp: Power (6 pins), Motor_Controller (19 pins)
GND: Power (21 pins), MCU (24 pins), Motor_Controller (21 pins), Sensors_and_External_Interfaces (J5.2 J6.2)
Motor_Backward: MCU (U3.24), Motor_Controller (R18.2 R33.1)
Motor_Forward: MCU (U3.23), Motor_Controller (R17.1 R34.1)
NetJ4_1: MCU (U3.59), Sensors_and_External_Interfaces (J4.1)
NetJ4_2: MCU (U3.54), Sensors_and_External_Interfaces (J4.2)
NetJ4_3: MCU (U3.53), Sensors_and_External_Interfaces (J4.3)
NetJ4_4: MCU (U3.52), Sensors_and_External_Interfaces (J4.4)
NetJ4_5: MCU (U3.48), Sensors_and_External_Interfaces (J4.5)
NetJ4_6: MCU (U3.47), Sensors_and_External_Interfaces (J4.6)
NetJ4_7: MCU (U3.32), Sensors_and_External_Interfaces (J4.7)
NetJ4_8: MCU (U3.30), Sensors_and_External_Interfaces (J4.8)
NetJ4_9: MCU (U3.25), Sensors_and_External_Interfaces (J4.9)
NetR26_2: MCU (U3.40), Motor_Controller (R26.2 R27.1)
NetR35_2: MCU (U3.79), Sensors_and_External_Interfaces (R35.2)
NetR36_2: MCU (U3.26), Sensors_and_External_Interfaces (R36.2)
NetR37_2: MCU (U3.78), Sensors_and_External_Interfaces (R37.2)
NetR38_2: MCU (U3.29), Sensors_and_External_Interfaces (R38.2)